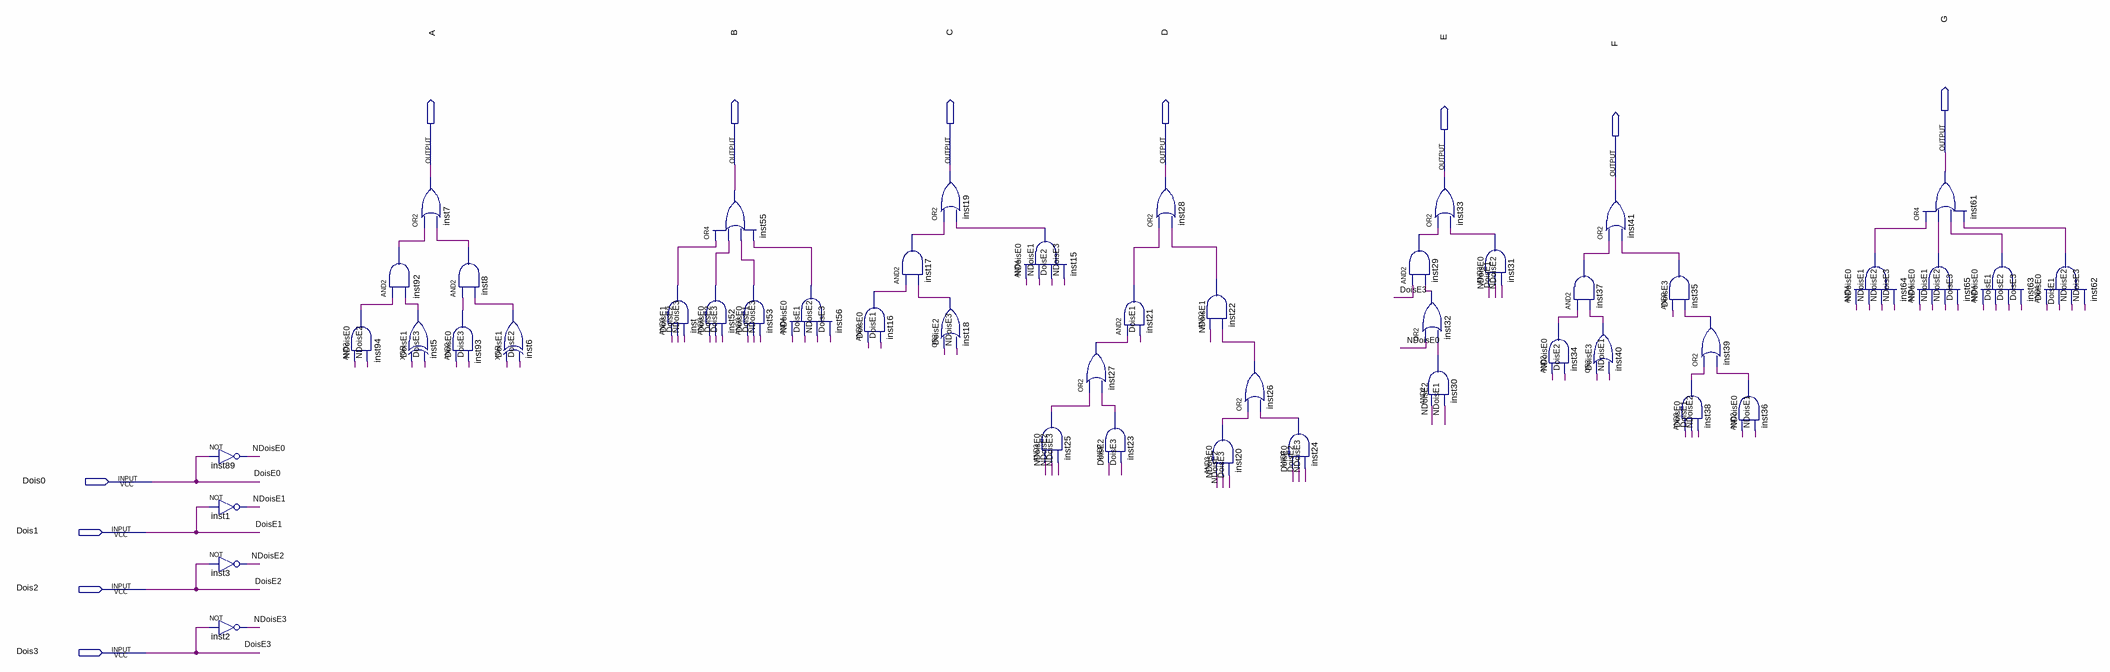
[diagram p0: schematic sheet]
// Quartus schematic aula5.bdf as structural Verilog: 48 symbols, 11 pins
module aula5 (
  input  Dois0,
  input  Dois1,
  input  Dois2,
  input  Dois3,
  output G,
  output A,
  output B,
  output C,
  output D,
  output E,
  output F
);

  wire inst5_out, inst6_out, inst8_out, inst15_out, inst16_out, inst17_out, inst18_out, inst20_out,
       inst21_out, inst22_out, inst23_out, inst24_out, inst25_out, inst26_out, inst27_out, inst29_out,
       inst30_out, inst31_out, inst32_out, inst34_out, inst35_out, inst36_out, inst37_out, inst38_out,
       inst39_out, inst40_out, inst52_out, inst53_out, inst56_out, inst62_out, inst63_out, inst64_out,
       inst65_out, inst92_out, inst93_out, inst94_out, inst_out, NDoisE0, NDoisE1, NDoisE2, NDoisE3;

  not inst89 (NDoisE0, Dois0);
  not inst1 (NDoisE1, Dois1);
  not inst3 (NDoisE2, Dois2);
  not inst2 (NDoisE3, Dois3);
  and inst94 (inst94_out, NDoisE0, NDoisE2);
  and inst92 (inst92_out, inst94_out, inst5_out);
  or inst7 (A, inst92_out, inst8_out);
  xor inst5 (inst5_out, Dois1, Dois3);
  and inst93 (inst93_out, Dois0, Dois3);
  and inst8 (inst8_out, inst93_out, inst6_out);
  xor inst6 (inst6_out, Dois1, Dois2);
  and inst (inst_out, Dois1, Dois2, NDoisE3);
  and inst52 (inst52_out, Dois0, Dois2, Dois3);
  or inst55 (B, inst_out, inst52_out, inst53_out, inst56_out);
  and inst53 (inst53_out, Dois0, Dois1, NDoisE3);
  and inst56 (inst56_out, NDoisE0, Dois1, NDoisE2, Dois3);
  and inst17 (inst17_out, inst16_out, inst18_out);
  and inst16 (inst16_out, Dois0, Dois1);
  or inst19 (C, inst17_out, inst15_out);
  or inst18 (inst18_out, Dois2, NDoisE3);
  and inst15 (inst15_out, NDoisE0, NDoisE1, Dois2, NDoisE3);
  and inst25 (inst25_out, NDoisE0, NDoisE2, NDoisE3);
  or inst27 (inst27_out, inst25_out, inst23_out);
  and inst23 (inst23_out, Dois2, Dois3);
  or inst28 (D, inst21_out, inst22_out);
  and inst21 (inst21_out, inst27_out, Dois1);
  and inst22 (inst22_out, NDoisE1, inst26_out);
  and inst20 (inst20_out, NDoisE0, NDoisE2, Dois3);
  or inst26 (inst26_out, inst20_out, inst24_out);
  and inst24 (inst24_out, Dois0, Dois2, NDoisE3);
  and inst29 (inst29_out, Dois3, inst32_out);
  or inst33 (E, inst29_out, inst31_out);
  or inst32 (inst32_out, NDoisE0, inst30_out);
  and inst30 (inst30_out, NDoisE2, NDoisE1);
  and inst31 (inst31_out, NDoisE0, Dois1, NDoisE2);
  and inst34 (inst34_out, NDoisE0, Dois2);
  or inst41 (F, inst37_out, inst35_out);
  and inst37 (inst37_out, inst34_out, inst40_out);
  or inst40 (inst40_out, Dois3, NDoisE1);
  and inst35 (inst35_out, Dois3, inst39_out);
  or inst39 (inst39_out, inst38_out, inst36_out);
  and inst38 (inst38_out, Dois0, Dois1, NDoisE2);
  and inst36 (inst36_out, NDoisE0, NDoisE1);
  and inst64 (inst64_out, NDoisE0, NDoisE1, NDoisE2, NDoisE3);
  or inst61 (G, inst64_out, inst65_out, inst63_out, inst62_out);
  and inst65 (inst65_out, NDoisE0, NDoisE1, NDoisE2, Dois3);
  and inst63 (inst63_out, NDoisE0, Dois1, Dois2, Dois3);
  and inst62 (inst62_out, Dois0, Dois1, NDoisE2, NDoisE3);

  // Other names for the same wires on the sheet: DoisE0 = Dois0; DoisE1 = Dois1; DoisE2 = Dois2; DoisE3 = Dois3
endmodule
